# Altium schematic sheet CurrentAcquisitionInline.SchDoc
size A3; SheetNumber: 6; SheetTotal: 6
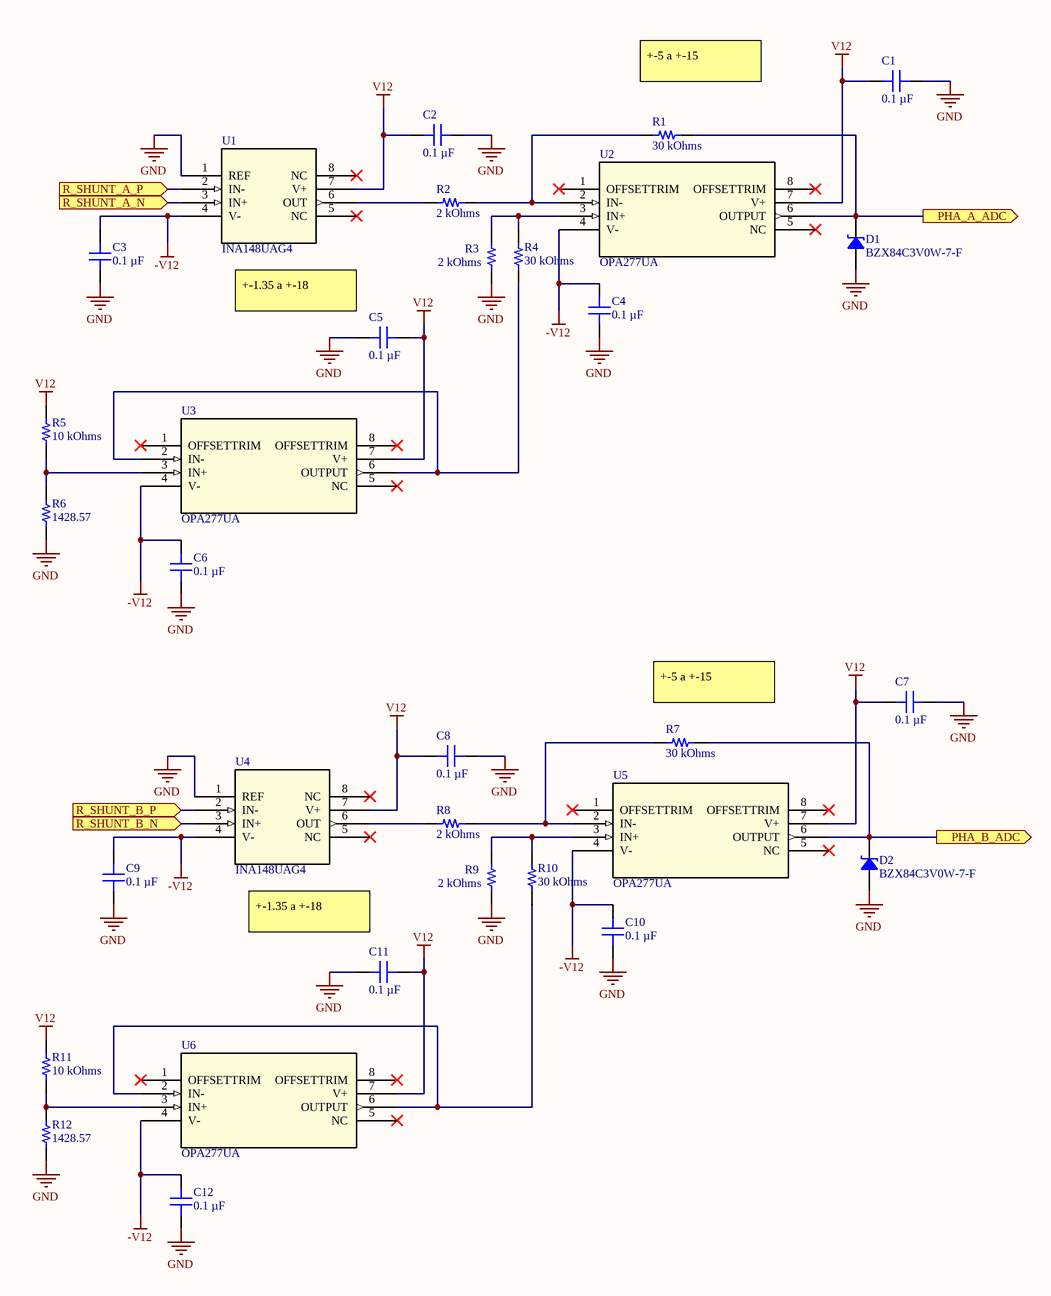
[diagram p0: CurrentAcquisitionInline.SchDoc]

## Parts
C1  0.1 µF  [CAP 0805_2012]
C2  0.1 µF  [CAP 0805_2012]
C3  0.1 µF  [CAP 0805_2012]
C4  0.1 µF  [CAP 0805_2012]
C5  0.1 µF  [CAP 0805_2012]
C6  0.1 µF  [CAP 0805_2012]
C7  0.1 µF  [CAP 0805_2012]
C8  0.1 µF  [CAP 0805_2012]
C9  0.1 µF  [CAP 0805_2012]
C10  0.1 µF  [CAP 0805_2012]
C11  0.1 µF  [CAP 0805_2012]
C12  0.1 µF  [CAP 0805_2012]
D1  BZX84C3V0W-7-F  [DIODES SOT-323-3]
D2  BZX84C3V0W-7-F  [DIODES SOT-323-3]
R1  30 kOhms  [RES 0805_2012]
R2  2 kOhms  [RES 0805_2012]
R3  2 kOhms  [RES 0805_2012]
R4  30 kOhms  [RES 0805_2012]
R5  10 kOhms  [RES 0805_2012]
R6  1428.57  [RES 0805_2012]
R7  30 kOhms  [RES 0805_2012]
R8  2 kOhms  [RES 0805_2012]
R9  2 kOhms  [RES 0805_2012]
R10  30 kOhms  [RES 0805_2012]
R11  10 kOhms  [RES 0805_2012]
R12  1428.57  [RES 0805_2012]
U1  INA148UAG4  [D8]
U2  OPA277UA  [D8]
U3  OPA277UA  [D8]
U4  INA148UAG4  [D8]
U5  OPA277UA  [D8]
U6  OPA277UA  [D8]

## Ports
PHA_A_ADC (out), PHA_B_ADC (out), R_SHUNT_A_N (in), R_SHUNT_A_P (in), R_SHUNT_B_N (in), R_SHUNT_B_P (in)

## Nets
-V12: C3.2 C4.2 C6.2 C9.2 C10.2 C12.2 U1.4(V-) U2.4(V-) U3.4(V-) U4.4(V-) U5.4(V-) U6.4(V-)
GND: C1.2 C2.2 C3.1 C4.1 C5.2 C6.1 C7.2 C8.2 C9.1 C10.1 C11.2 C12.1 D1.1 D2.1 R3.1 R6.2 R9.2 R12.2 U1.1(REF) U4.1(REF)
V12: C1.1 C2.1 C5.1 C7.1 C8.1 C11.1 R5.1 R11.1 U1.7(V+) U2.7(V+) U3.7(V+) U4.7(V+) U5.7(V+) U6.7(V+)
PHA_A_ADC: D1.2 R1.1 U2.6(OUTPUT) ; port PHA_A_ADC
PHA_B_ADC: D2.2 R7.1 U5.6(OUTPUT) ; port PHA_B_ADC
R_SHUNT_A_N: U1.3(IN+) ; port R_SHUNT_A_N
R_SHUNT_A_P: U1.2(IN-) ; port R_SHUNT_A_P
R_SHUNT_B_N: U4.3(IN+) ; port R_SHUNT_B_N
R_SHUNT_B_P: U4.2(IN-) ; port R_SHUNT_B_P
NetR1_2: R1.2 R2.1 U2.2(IN-)
NetR2_2: R2.2 U1.6(OUT)
NetR3_2: R3.2 R4.1 U2.3(IN+)
NetR4_2: R4.2 U3.2(IN-) U3.6(OUTPUT)
NetR5_1: R5.1 R6.1 U3.3(IN+)
NetR7_1: R7.1 R8.2 U5.2(IN-)
NetR8_1: R8.1 U4.6(OUT)
NetR9_1: R9.1 R10.1 U5.3(IN+)
NetR10_2: R10.2 U6.2(IN-) U6.6(OUTPUT)
NetR11_1: R11.1 R12.1 U6.3(IN+)

Not connected (* = marked no-connect by the designer): U1 5(NC)* 8(NC)*; U2 1(OFFSETTRIM)* 5(NC)* 8(OFFSETTRIM)*; U3 1(OFFSETTRIM)* 5(NC)* 8(OFFSETTRIM)*; U4 5(NC)* 8(NC)*; U5 1(OFFSETTRIM)* 5(NC)* 8(OFFSETTRIM)*; U6 1(OFFSETTRIM)* 5(NC)* 8(OFFSETTRIM)*

## Notes on the sheet
- +-5 a +-15
- (near C5) +-1.35 a +-18
- (near R7) +-5 a +-15
- +-1.35 a +-18

## Library data of the parts
C1-C12 = CC0805MRX7R9BB104: CAP CER 0.1UF 50V X7R 0805; manufacturer: Yageo; Tolerance: ±20%; Part Number: CC0805MRX7R9BB104; Value: 0.1 µF; Applications: General Purpose; Capacitance: 0.1 µF; componentlink1description: Datasheet; componentlink1url: https://www.yageo.com/upload/media/product/productsearch/datasheet/mlcc/UPY-GPHC_X7R_6.3V-to-50V_18.pdf; componentlink2description: DigiKey Link; componentlink2url: https://www.digikey.com/en/products/detail/yageo/CC0805MRX7R9BB104/5884281; Device Package: 0805 (2012 Metric); lastupdated: 15/11/2023 20:14:20; Lifecycle Status: Active; Minimum Order: 1; Mounting Type: Surface Mount, MLCC; Operating Temperature: -55°C ~ 125°C; Package / Case: 0805 (2012 Metric); packaging: TapeAndReel; partid: 2475; Part Status: Active; price: 0.01; series: CC; Size / Dimension: 0.079" L x 0.049" W (2.00mm x 1.25mm); Supplier 1: DigiKey; Supplier Part Number 1: 311-4351-1-ND; Temperature Coefficient: X7R; Thickness (Max): 0.037" (0.95mm); Voltage - Rated: 50V
D1 D2 = BZX84C3V0W-7-F: DIODE ZENER 3V 200MW SOT323; Manufacturer: Diodes Incorporated; Current - Reverse Leakage @ Vr: 20 µA @ 1 V; Impedance (Max) (Zzt): 95 Ohms; Tolerance: ±7%; Voltage - Forward (Vf) (Max) @ If: 900 mV @ 10 mA; Part Number: BZX84C3V0W-7-F; ComponentLink1Description: Datasheet; ComponentLink1URL: https://www.diodes.com/assets/Datasheets/ds30066.pdf; ComponentLink2Description: DigiKey Link; ComponentLink2URL: https://www.digikey.com/en/products/detail/diodes-incorporated/BZX84C3V0W-7-F/814837; LastUpdated: 24/11/2023 21:30:31; Lifecycle Status: Active; Minimum Order: 1; Mounting Type: Surface Mount; Operating Temperature: -65°C ~ 125°C; Package / Case: SC-70, SOT-323; Packaging: TapeAndReel; PartId: 887; Part Status: Active; Power - Max: 200 mW; Price: 0.03; Series: -; Supplier 1: DigiKey; Supplier Part Number 1: BZX84C3V0W-FDICT-ND; Supplier Device Package: SOT-323; Voltage - Zener (Nom) (Vz): 3 V
R1-R12 = CR0805-JW-204ELF: RES SMD 200K OHM 5% 1/8W 0805; Manufacturer: Bourns Inc.; Power (Watts): 0.125W, 1/8W; Resistance: 200 kOhms; Temperature Coefficient: ±200ppm/°C; Part Number: CR0805-JW-204ELF; ComponentLink1Description: Datasheet; ComponentLink1URL: https://www.bourns.com/docs/product-datasheets/cr.pdf?sfvrsn=574d41f6_14; ComponentLink2Description: DigiKey Link; ComponentLink2URL: https://www.digikey.com/en/products/detail/bourns-inc/CR0805-JW-204ELF/3785267; Composition: Thick Film; Device Package: 0805 (2012 Metric); Features: Moisture Resistant; Height - Seated (Max): 0.024" (0.60mm); LastUpdated: 02/11/2023 20:02:13; Lifecycle Status: Active; Minimum Order: 1; Number of Terminations: 2; Operating Temperature: -55°C ~ 155°C; Package / Case: 0805 (2012 Metric); Packaging: TapeAndReel; PartId: 69673; Part Status: Active; Price: 0.01; Series: CR0805; Size / Dimension: 0.079" L x 0.049" W (2.00mm x 1.25mm); Supplier 1: DigiKey; Supplier Part Number 1: 118-CR0805-JW-204ELFCT-ND; Supplier Device Package: 0805; Tolerance: ±5%
  R1 R4 R7 R10: Value: 30 kOhms
  R2 R3 R8 R9: Value: 2 kOhms
  R5 R11: Value: 10 kOhms
  R6 R12: Value: 1428.57
U1 U4 = INA148UAG4: No Description Available; Mfr_Name: Texas Instruments; Copyright: Copyright (C) 2023 Ultra Librarian. All rights reserved.; Manufacturer_Part_Number: INA148UAG4; RefDes: RefDes; Type: DEV
U2 U3 U5 U6 = OPA277UA: No Description Available; Mfr_Name: Texas Instruments; Copyright: Copyright (C) 2023 Ultra Librarian. All rights reserved.; Manufacturer_Part_Number: OPA277UA; RefDes: RefDes; Type: DEV